# Altium schematic sheet CAp_TOP.SchDoc
size A4; Author: Audran; CompanyName: Goldorak; Address1: Electrolab; Address2: 52 rue Paul Lescop; Address3: 92000 Nanterre; ProjectName: Cartes_2017
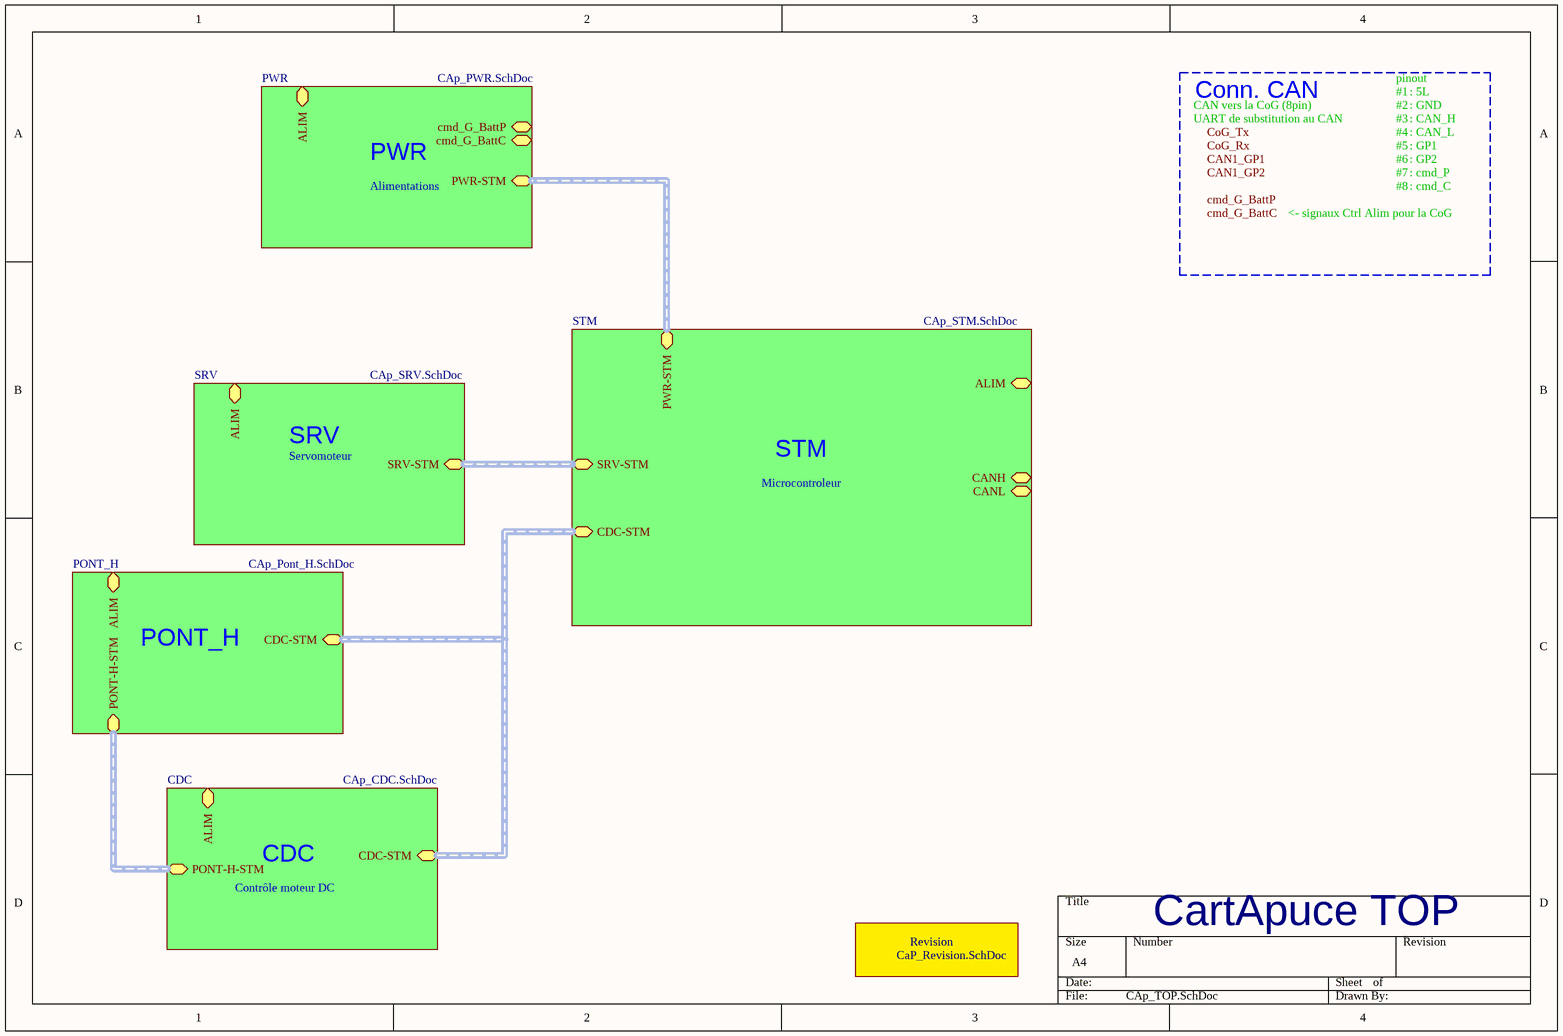
[diagram p0: CAp_TOP.SchDoc]

## Sub-sheets
CDC = CAp_CDC.SchDoc: CDC-STM (harness CDC-STM), ALIM (harness ALIM), PONT-H-STM (harness PONT-H-STM)
PONT_H = CAp_Pont_H.SchDoc: CDC-STM (harness CDC-STM), ALIM (harness ALIM), PONT-H-STM (harness PONT-H-STM)
PWR = CAp_PWR.SchDoc: PWR-STM (harness PWR-STM), ALIM (harness ALIM), cmd_G_BattP, cmd_G_BattC
Revision = CaP_Revision.SchDoc: no entries
SRV = CAp_SRV.SchDoc: SRV-STM (harness SRV-STM), ALIM (harness ALIM)
STM = CAp_STM.SchDoc: SRV-STM (harness SRV-STM), PWR-STM (harness PWR-STM), CDC-STM (harness CDC-STM), ALIM (harness ALIM), CANH, CANL

## Buses and harness runs
harness sheet CDC/CDC-STM = sheet PONT_H/CDC-STM = sheet STM/CDC-STM
harness sheet CDC/PONT-H-STM = sheet PONT_H/PONT-H-STM
harness sheet PWR/PWR-STM = sheet STM/PWR-STM
harness sheet SRV/SRV-STM = sheet STM/SRV-STM

## Notes on the sheet
- CAN vers la CoG (8pin)
- Conn. CAN
- #1
- #2
- pinout
- : 5L
- : GND
- PWR
- UART de substitution au CAN
- #3
- #4
- #5
- #6
- #7
- : CAN_H
- : CAN_L
- : GP1
- : GP2
- : cmd_P
- Alimentations
- <- signaux Ctrl Alim pour la CoG
- #8
- : cmd_C
- SRV
- Servomoteur
- Microcontroleur
- STM
- PONT_H
- Contrôle moteur DC
- CDC
- CartApuce TOP
- Labels drawn without touching a wire or pin: CAN1_GP1, CAN1_GP2, cmd_G_BattC, cmd_G_BattP, CoG_Rx, CoG_Tx